# EAGLE schematic top (EAGLE 7.6.0)
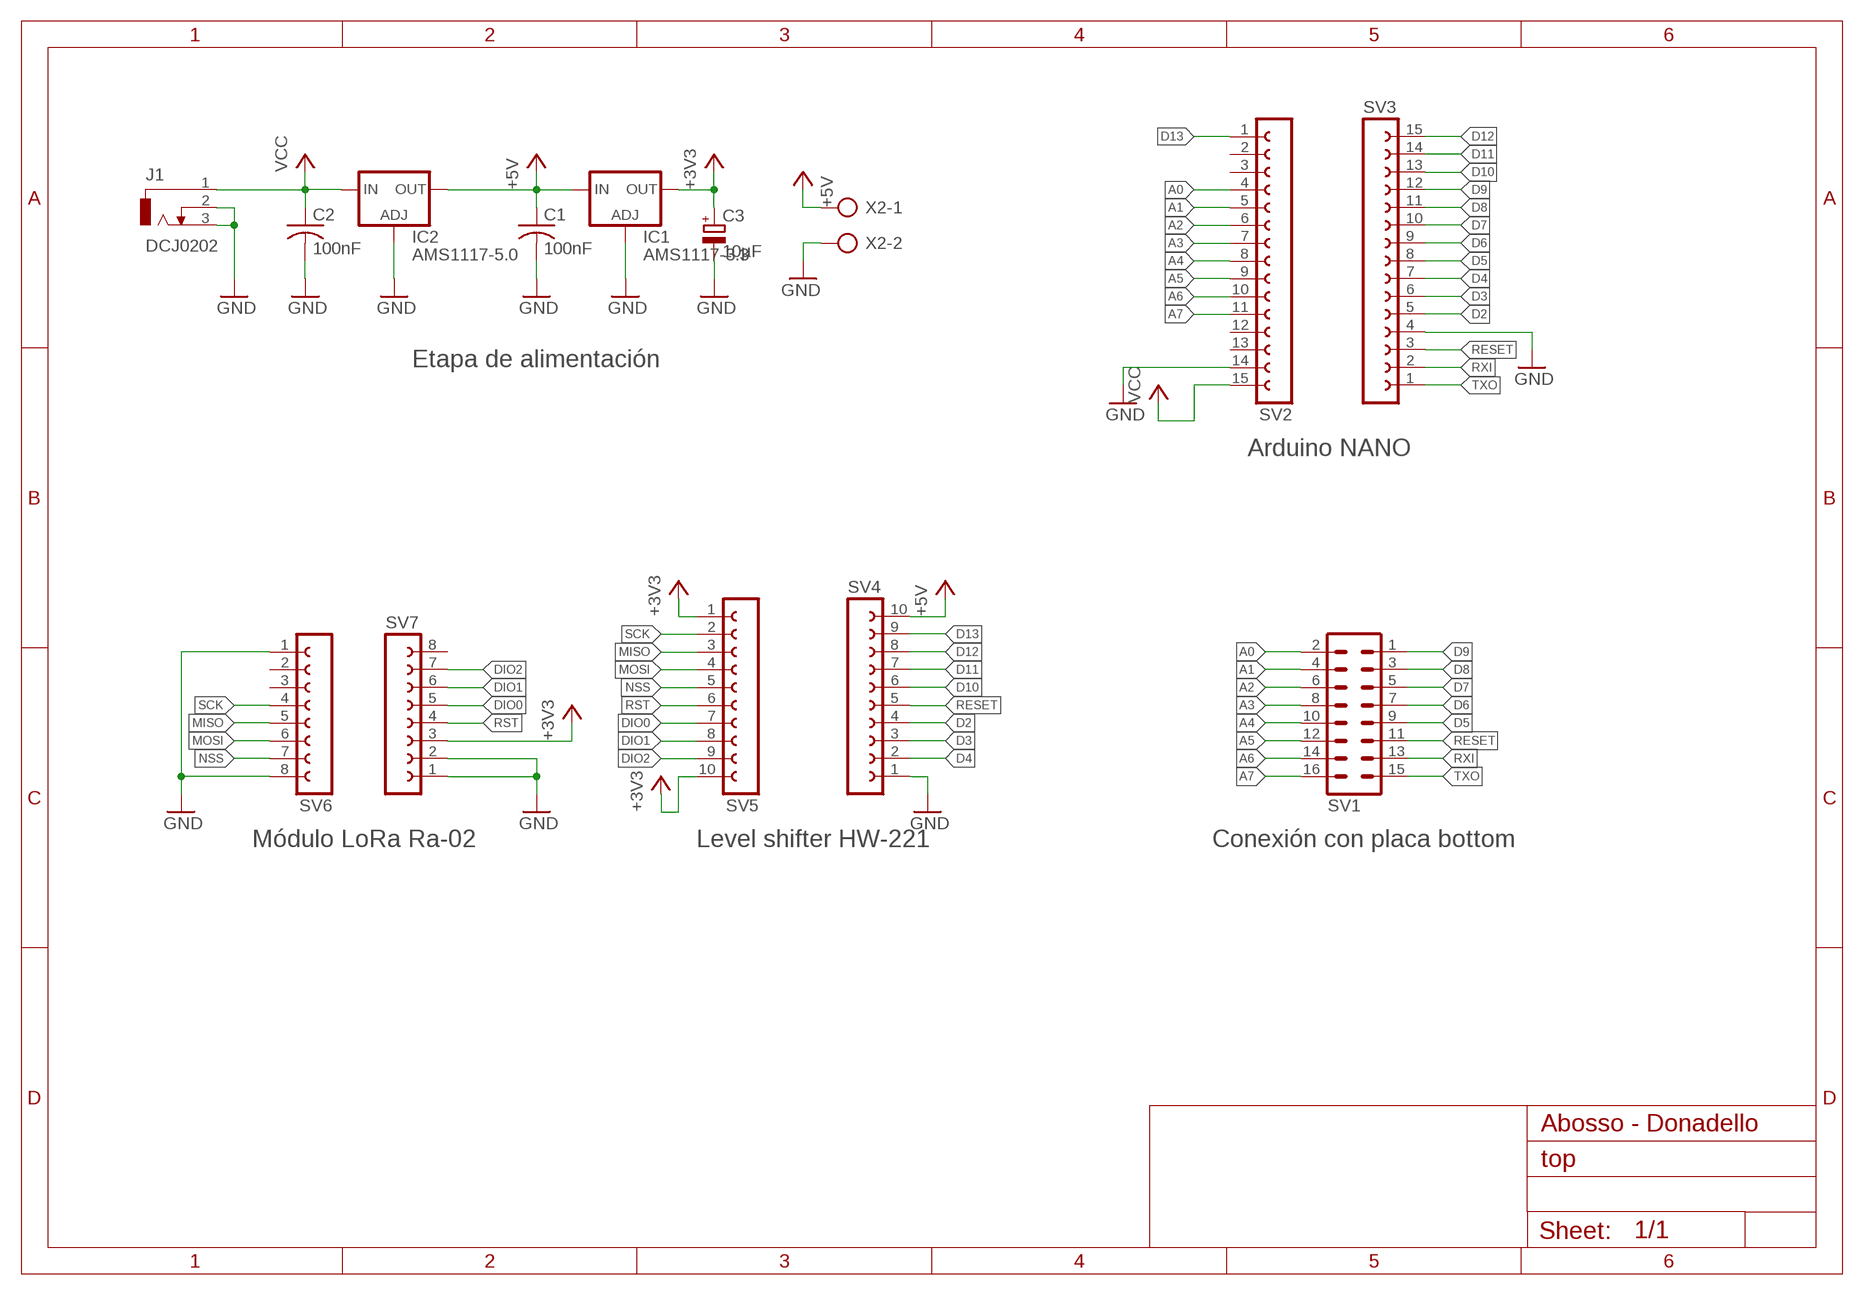
[diagram p0: schematic, sheet 1]

## Parts
C1  100nF  C-USC0805  [C0805]
C2  100nF  C-USC0805  [C0805]
C3  10µF  CPOL-EUB  [PANASONIC_B]
IC1  AMS1117-3.3  LD117AS33TR  [SOT223]
IC2  AMS1117-5.0  LD117AS50TR  [SOT223]
J1  DCJ0202  [DCJ0202]
SV1  MA08-2  [MA08-2]
SV2  FE15-1  [FE15]
SV3  FE15-1  [FE15]
SV4  FE10-1  [FE10]
SV5  FE10-1  [FE10]
SV6  FE08-1  [FE08]
SV7  FE08-1  [FE08]
X2  AK500/2  [AK500/2]

## Nets
+3V3: C3.+ IC1.4(OUT) SV5.1 SV5.10 SV7.3
+5V: C1.1 IC1.3(IN) IC2.4(OUT) SV4.10 X2.1
A0: SV1.2 SV2.4
A1: SV1.4 SV2.5
A2: SV1.6 SV2.6
A3: SV1.8 SV2.7
A4: SV1.10 SV2.8
A5: SV1.12 SV2.9
A6: SV1.14 SV2.10
A7: SV1.16 SV2.11
D2: SV3.5 SV4.4
D3: SV3.6 SV4.3
D4: SV3.7 SV4.2
D5: SV1.9 SV3.8
D6: SV1.7 SV3.9
D7: SV1.5 SV3.10
D8: SV1.3 SV3.11
D9: SV1.1 SV3.12
D10: SV3.13 SV4.6
D11: SV3.14 SV4.7
D12: SV3.15 SV4.8
D13: SV2.1 SV4.9
DIO0: SV5.7 SV7.5
DIO1: SV5.8 SV7.6
DIO2: SV5.9 SV7.7
GND: C1.2 C2.2 C3.- IC1.1(ADJ) IC2.1(ADJ) J1.2 J1.3 SV2.14 SV3.4 SV4.1 SV6.1 SV6.8 SV7.1 SV7.2 X2.2
MISO: SV5.3 SV6.5
MOSI: SV5.4 SV6.6
NSS: SV5.5 SV6.7
RESET: SV1.11 SV3.3 SV4.5
RST: SV5.6 SV7.4
RXI: SV1.13 SV3.2
SCK: SV5.2 SV6.4
TXO: SV1.15 SV3.1
VCC: C2.1 IC2.3(IN) J1.1 SV2.15
Unconnected: SV2.2 SV2.3 SV2.12 SV2.13 SV6.2 SV6.3 SV7.8

## Notes on the sheet
- Etapa de alimentación
- Arduino NANO
- Módulo LoRa Ra-02 | Level shifter HW-221 | Conexión con placa bottom
- Abosso - Donadello

## Library data of the parts
C1 C2 = rcl:C-US: CAPACITOR, American symbol
C3 = rcl:CPOL-EU: POLARIZED CAPACITOR, European symbol
IC1 IC2 = v-reg:LD117A?*: Low drop fixed and adjustable positive voltage regulators 1 A Source: http://www.st.com/stonline/products/literature/ds/7194/ld1117axx.pdf
J1 = con-jack:DCJ0202: DC POWER JACK Source: DCJ0202.pdf; OC_FARNELL: unknown; OC_NEWARK: unknown
SV1 = con-lstb:MA08-2: PIN HEADER; OC_FARNELL: unknown; OC_NEWARK: unknown
SV2 SV3 = con-lsta:FE15-1: FEMALE HEADER; OC_FARNELL: unknown; OC_NEWARK: unknown
SV4 SV5 = con-lsta:FE10-1: FEMALE HEADER; OC_FARNELL: unknown; OC_NEWARK: unknown
SV6 SV7 = con-lsta:FE08-1: FEMALE HEADER; OC_FARNELL: unknown; OC_NEWARK: unknown
X2 = con-ptr500:AK500/2: CONNECTOR; OC_FARNELL: unknown; OC_NEWARK: unknown

## Net classes
0 default: width 0.203 mm
1 vcc: width 0.254 mm